# Altium schematic sheet KV2_MotionA12 - 副本.SchDoc
size A3; PageSetup: Record=PageOptions|CenterHorizontal=True|CenterVertical=True|PrintScale=1.00|XCorrection=1.00|YCorrection=1.00|PrintKind=2|BorderSize=5000000|LeftOffset=0|BottomOffset=0|Orientation=2|PaperLength=1000|PaperWidth=1000|Scale=100|PaperSource=7|PrintQuality=-4|MediaType=1|DitherType=10|PaperKind=A3|PrintScaleMode=1
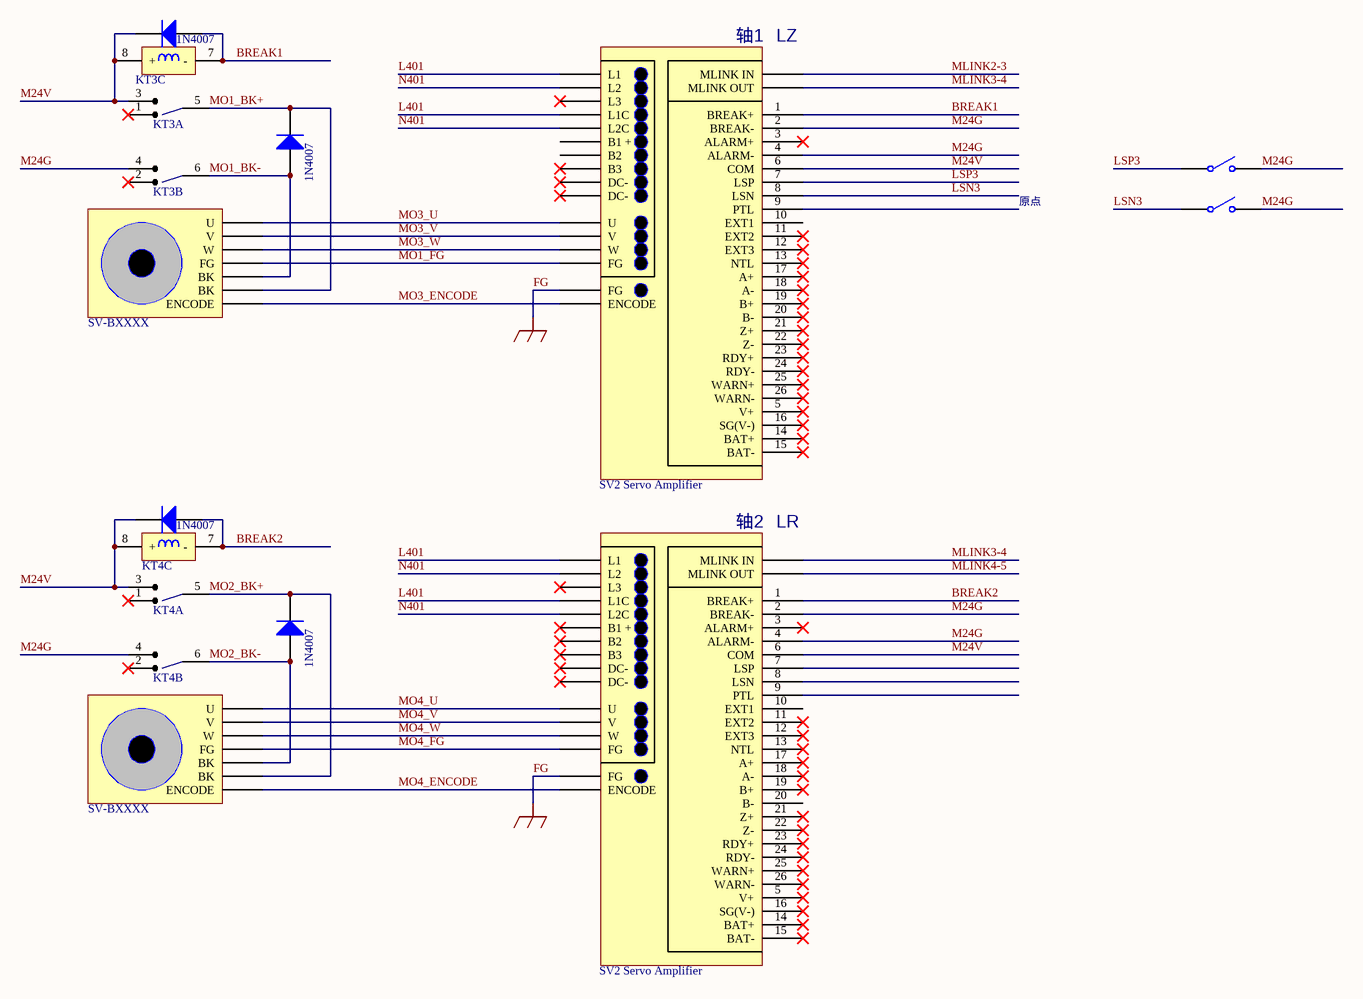
[diagram p0: KV2_MotionA12 - 副本.SchDoc]

## Parts
(Parts that share a designator on the sheet are numbered #1, #2 ... from top to bottom, then left to right.)
*#1  SV2 Servo Amplifier
*#2  SV-BXXXX
*#3  SV2 Servo Amplifier
*#4  SV-BXXXX
D?#1  1N4007  [DO-41]
D?#2  1N4007  [DO-41]
D?#3  1N4007  [DO-41]
D?#4  1N4007  [DO-41]
KT3  LY2N-J  (value not drawn)  (parts A,B,C of 3)
KT4  LY2N-J  (value not drawn)  (parts A,B,C of 3)
S?#1  SW-SPST  [SPST-2]  (value not drawn)
S?#2  SW-SPST  [SPST-2]  (value not drawn)

## Nets
FG: *#1.X43(FG) *#3.X43(FG)  [also labelled GND]
BREAK1: *#1.1(BREAK+) D?#1.1(A) KT3.7(-)
BREAK2: *#3.1(BREAK+) D?#3.1(A) KT4.7(-)
L401: *#1.X34(L1) *#1.X37(L1C) *#3.X34(L1) *#3.X37(L1C)
LSN3: *#1.8(LSN) S?#2.1(COMMON)
LSP3: *#1.7(LSP) S?#1.1(COMMON)
M24G: *#1.2(BREAK-) *#1.4(ALARM-) *#3.2(BREAK-) *#3.4(ALARM-) KT3.4 KT4.4 S?#1.2(NO) S?#2.2(NO)
M24V: *#1.6(COM) *#3.6(COM) D?#1.2(K) D?#3.2(K) KT3.3 KT3.8(+) KT4.3 KT4.8(+)
MLINK2-3: *#1.X44(MLINK_IN)
MLINK3-4: *#1.X44(MLINK_OUT) *#3.X44(MLINK_IN)
MLINK4-5: *#3.X44(MLINK_OUT)
MO1_BK+: *#2.31(BK) D?#2.2(K) KT3.5
MO1_BK-: *#2.30(BK) D?#2.1(A) KT3.6
MO1_FG: *#1.X43(FG) *#2.29(FG)
MO2_BK+: *#4.31(BK) D?#4.2(K) KT4.5
MO2_BK-: *#4.30(BK) D?#4.1(A) KT4.6
MO3_ENCODE: *#1.X44(ENCODE) *#2.29(ENCODE)
MO3_U: *#1.X43(DC-) *#2.27(U)
MO3_V: *#1.X43(V) *#2.28(V)
MO3_W: *#1.X43(W) *#2.29(W)
MO4_ENCODE: *#3.X44(ENCODE) *#4.29(ENCODE)
MO4_FG: *#3.X43(FG) *#4.29(FG)
MO4_U: *#3.X43(DC-) *#4.27(U)
MO4_V: *#3.X43(V) *#4.28(V)
MO4_W: *#3.X43(W) *#4.29(W)
N401: *#1.X35(L2) *#1.X38(L2C) *#3.X35(L2) *#3.X38(L2C)

Not connected (* = marked no-connect by the designer): *#1 3(ALARM+)* 5(V+)* 9(PTL) 10(EXT1) 11(EXT2)* 12(EXT3)* 13(NTL)* 14(BAT+)* 15(BAT-)* 16(SG(V-))* 17(A+)* 18(A-)* 19(B+)* 20(B-)* 21(Z+)* 22(Z-)* 23(RDY+)* 24(RDY-)* 25(WARN+)* 26(WARN-)* X36(L3)* X39(B1_+) X40(B2) X41(B3)* X42(DC-)*; *#3 3(ALARM+)* 5(V+)* 7(LSP) 8(LSN) 9(PTL) 10(EXT1) 11(EXT2)* 12(EXT3)* 13(NTL)* 14(BAT+)* 15(BAT-)* 16(SG(V-))* 17(A+)* 18(A-)* 19(B+)* 20(B-) 21(Z+)* 22(Z-)* 23(RDY+)* 24(RDY-)* 25(WARN+)* 26(WARN-)* X36(L3)* X39(B1_+)* X40(B2)* X41(B3)* X42(DC-)*; KT3 1* 2*; KT4 1* 2*

## Notes on the sheet
- (near *#1) 轴1
- (near *#1) LZ
- 原点
- (near *#3) 轴2
- (near *#3) LR

## Library data of the parts
D?#1-D?#4 = Diode 1N4007: 1 Amp General Purpose Rectifier; Published: 8-Jun-2000; LatestRevisionDate: 17-Jul-2002; LatestRevisionNote: Re-released for DXP Platform.; DatasheetVersion: 1998; PackageVersion: Aug-1999; PackageReference: DO-41; Publisher: Altium Limited; PackageDescription: Diode, Axial; Body 5.2 x 2.7 mm (LxDia. max), Lead Dia. 0.86 mm (max); Code_JEDEC: DO-204-AL; ComponentLink1Description: Manufacturer Link; ComponentLink1URL: http://www.fairchildsemi.com/; ComponentLink2Description: Datasheet; ComponentLink2URL: http://www.fairchildsemi.com/ds/1N%2F1N4001.pdf
S?#1 S?#2 = SW-SPST: Single-Pole, Single-Throw Switch; Published: 24-Mar-1999; LatestRevisionDate: 17-Jul-2002; LatestRevisionNote: Re-released for DXP Platform.; PackageReference: SPST-2; Publisher: Altium Limited